# EAGLE design QuackDrive (EAGLE 9.2.2)

## Sheet 1 of 3
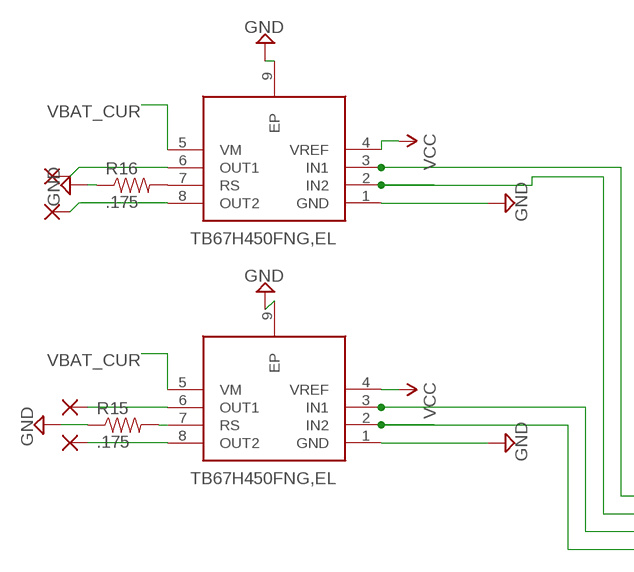
[diagram p0: schematic, sheet 1, part 1 of 2]
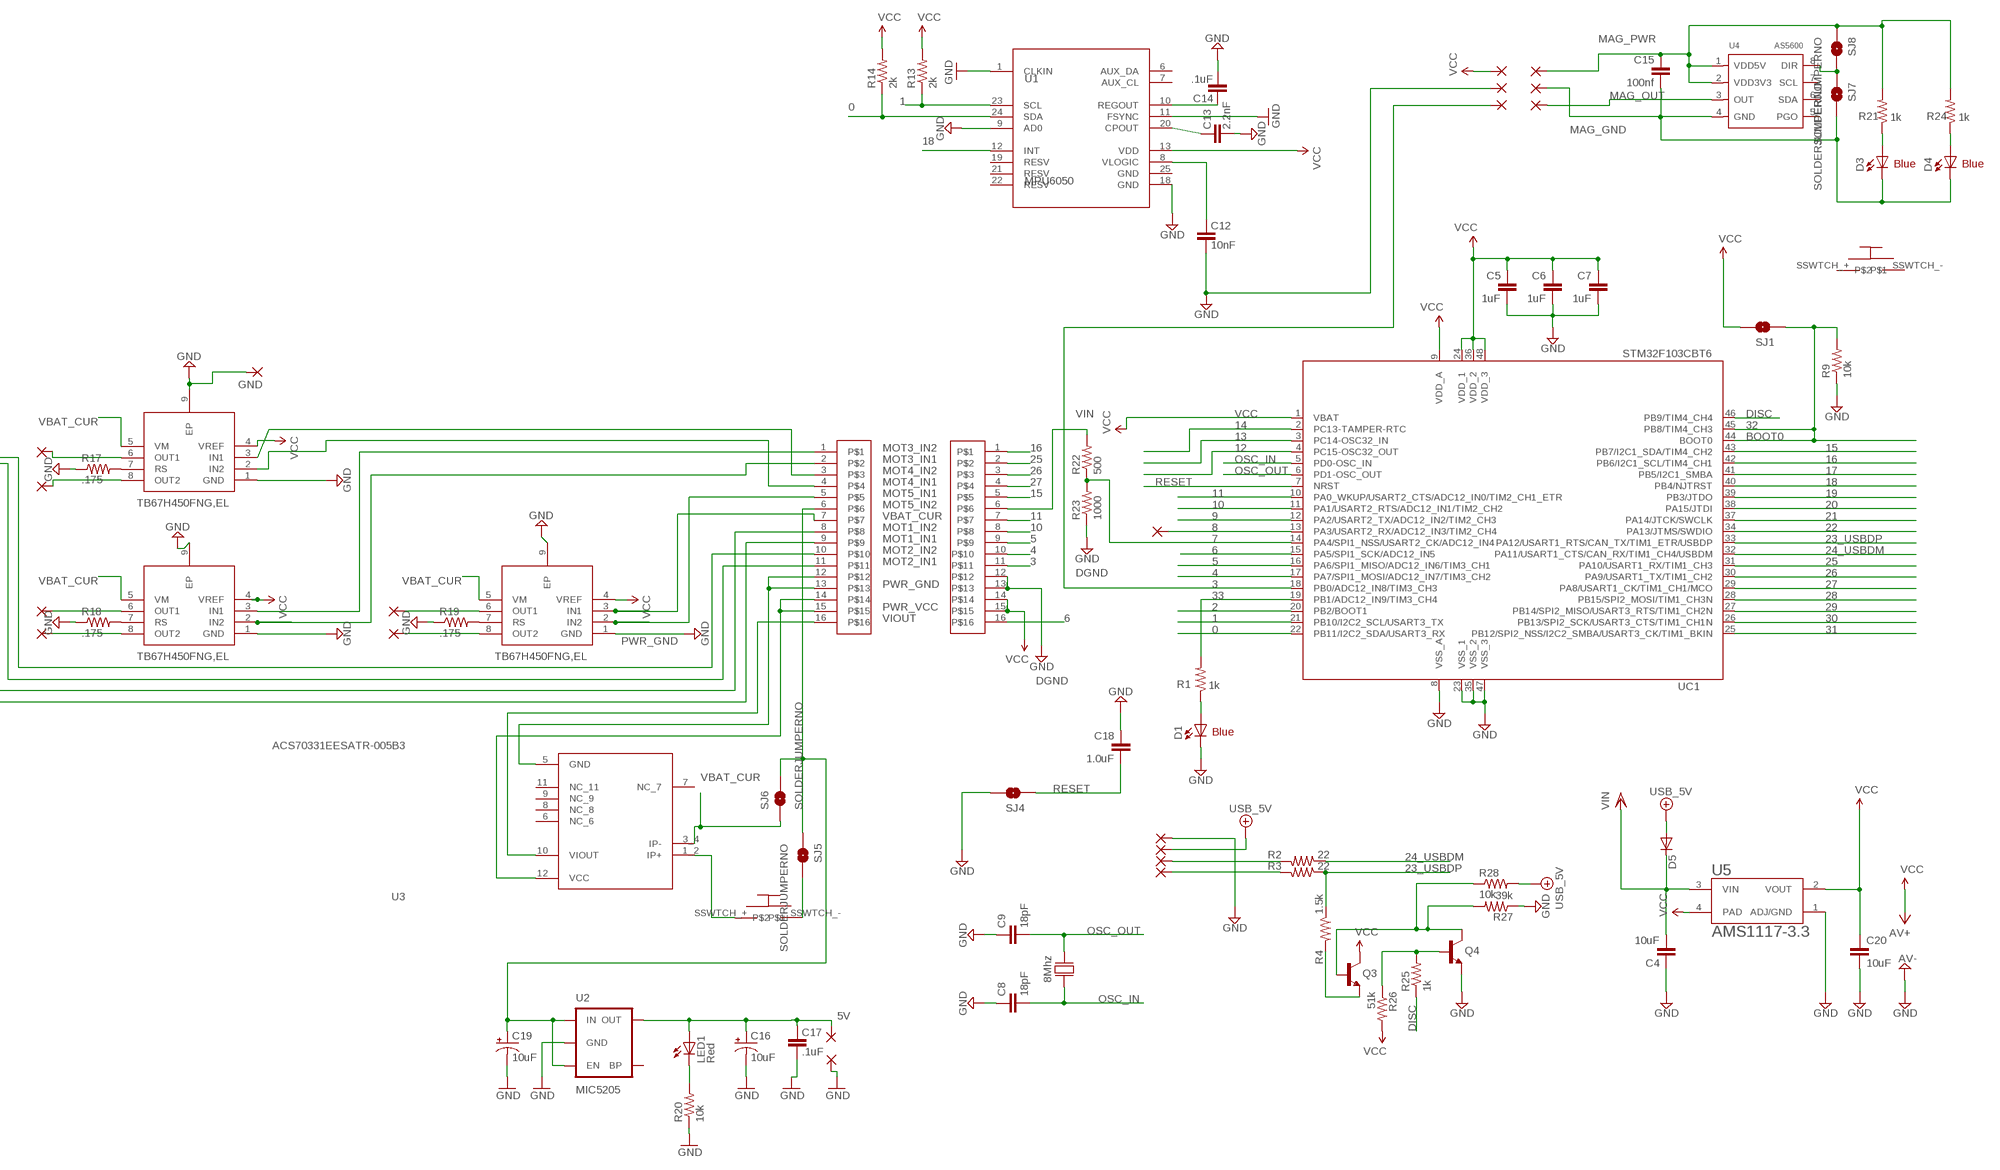
[diagram p1: schematic, sheet 1, part 2 of 2]

### Parts
C4  10uF  CAP0805  [0805]
C5  1uF  CAP0402  [C0402]
C6  1uF  CAP0402  [C0402]
C7  1uF  CAP0402  [C0402]
C8  18pF  18PF-0603-50V-5%  [0603]
C9  18pF  18PF-0603-50V-5%  [0603]
C12  10nF  CAP0402  [C0402]
C13  2.2nF  CAP0402  [C0402]
C14  .1uF  CAP0402  [C0402]
C15  100nf  CAP0402  [C0402]
C16  10uF  CAP_POL1206  [EIA3216]
C17  .1uF  CAP0402  [C0402]
C18  1.0uF  1.0UF-0603-16V-10%  [0603]
C19  10uF  CAP_POL1206  [EIA3216]
C20  10uF  CAP0805  [0805]
D1  Blue  LED1206  [LED-1206]
D3  Blue  LED1206  [LED-1206]
D4  Blue  LED1206  [LED-1206]
D5  DIODESOD  [SOD-323]
GND  SMD5  [SMD2,54-5,08]
IC4  TB67H450FNG,EL  [SOIC127P600X175-9N]
IC6  TB67H450FNG,EL  [SOIC127P600X175-9N]
IC8  TB67H450FNG,EL  [SOIC127P600X175-9N]
IC10  TB67H450FNG,EL  [SOIC127P600X175-9N]
IC12  TB67H450FNG,EL  [SOIC127P600X175-9N]
LED1  Red  LED  [0603-LED-ALT1]
PAD1  WIREPADSMD1,27-254  [SMD1,27-2,54]
PAD2  WIREPADSMD1,27-254  [SMD1,27-2,54]
PAD3  WIREPADSMD1,27-254  [SMD1,27-2,54]
PAD4  SMD2  [SMD1,27-2,54]
PAD5  WIREPADSMD1,27-254  [SMD1,27-2,54]
PAD6  WIREPADSMD1,27-254  [SMD1,27-2,54]
PAD7  SMD2  [SMD1,27-2,54]
PAD8  WIREPADSMD1,27-254  [SMD1,27-2,54]
PAD9  WIREPADSMD1,27-254  [SMD1,27-2,54]
PAD10  WIREPADSMD1,27-254  [SMD1,27-2,54]
PAD11  WIREPADSMD1,27-254  [SMD1,27-2,54]
PAD12  WIREPADSMD1,27-254  [SMD1,27-2,54]
PAD13  SMD2  [SMD1,27-2,54]
PAD14  SMD2  [SMD1,27-2,54]
PAD15  SMD2  [SMD1,27-2,54]
PAD16  SMD2  [SMD1,27-2,54]
PAD21  SMD2  [SMD1,27-2,54]
PAD22  SMD2  [SMD1,27-2,54]
PAD23  SMD2  [SMD1,27-2,54]
PAD24  SMD2  [SMD1,27-2,54]
PAD25  SMD2  [SMD1,27-2,54]
PAD26  SMD2  [SMD1,27-2,54]
PAD27  SMD2  [SMD1,27-2,54]
Q3  NPN-BJT  TRANSISTOR_NPNSOT23  [SOT23]
Q4  NPN-BJT  TRANSISTOR_NPNSOT23  [SOT23]
R1  1k  RESISTOR0402  [C0402]
R2  22  22OHM-0603-1/10W-1%  [0603]
R3  22  22OHM-0603-1/10W-1%  [0603]
R4  1.5k  22OHM-0603-1/10W-1%  [0603]
R9  10k  RESISTOR0402  [C0402]
R13  2k  RESISTOR0402  [C0402]
R14  2k  RESISTOR0402  [C0402]
R15  .175  RESISTOR0402  [C0402]
R16  .175  RESISTOR0402  [C0402]
R17  .175  RESISTOR0402  [C0402]
R18  .175  RESISTOR0402  [C0402]
R19  .175  RESISTOR0402  [C0402]
R20  10k  RESISTOR0402  [C0402]
R21  1k  RESISTOR0402  [C0402]
R22  500  RESISTOR0402  [C0402]
R23  1000  RESISTOR0402  [C0402]
R24  1k  RESISTOR0402  [C0402]
R25  1k  1KOHM-0603-1/10W-1%  [0603]
R26  51k  47KOHM-0603-1/10W-1%  [0603]
R27  39k  39KOHM-0603-1/10W-1%  [0603]
R28  10k  10KOHM-0603-1/10W-1%  [0603]
SJ1  SOLDERJUMPERNO  [SJ_2S-NO]
SJ4  SOLDERJUMPERNO  [SJ_2S-NO]
SJ5  SOLDERJUMPERNO  [SJ_2S-NO]
SJ6  SOLDERJUMPERNO  [SJ_2S-NO]
SJ7  SOLDERJUMPERNO  [SJ_2S-NO]
SJ8  SOLDERJUMPERNO  [SJ_2S-NO]
U1  MPU6050  [QFN50P400X400X95-25T265X275N]
U2  MIC5205  V_REG_LDOSMD  [SOT23-5]
U3  ACS70331EESATR-005B3  [XDCR_ACS70331EESATR-005B3]
U4  AS5600  SENSOR-AS5600  [SOIC8-1.27-5X4MM]
U5  AMS1117-3.3  [SOT229P700X180-4N]
U$1  WM8952DKR  [SOP80P420X355-16N]
U$2  SSWTCH  [SSWITCH]
U$3  WM8952DKR  [SOP80P420X355-16N]
U$4  SSWTCH  [SSWITCH]
U$9  8MHZCRYSTAL  [8MHZCRYSTAL]
UC1  STM32F103CBT6  STM32F103CB  [LQFP48]

### Nets
0: R14.1 U1.24(SDA) UC1.22(PB11/I2C2_SDA/USART3_RX)
1: R13.1 U1.23(SCL) UC1.21(PB10/I2C2_SCL/USART3_TX)
2: UC1.20(PB2/BOOT1)
3: PAD14.1(P) U$3.11 UC1.18(PB0/ADC12_IN8/TIM3_CH3)
4: U$3.10 UC1.17(PA7/SPI1_MOSI/ADC12_IN7/TIM3_CH2)
5: U$3.9 UC1.16(PA6/SPI1_MISO/ADC12_IN6/TIM3_CH1)
5V [vcc]: C16.A(+) C17.2 LED1.A PAD21.1(P) U2.5(OUT)
6: U$3.16 UC1.15(PA5/SPI1_SCK/ADC12_IN5)
7: R22.1 R23.2 UC1.14(PA4/SPI1_NSS/USART2_CK/ADC12_IN4)
8: PAD23.1(P) UC1.13(PA3/USART2_RX/ADC12_IN3/TIM2_CH4)
9: UC1.12(PA2/USART2_TX/ADC12_IN2/TIM2_CH3)
10: U$3.8 UC1.11(PA1/USART2_RTS/ADC12_IN1/TIM2_CH2)
11: U$3.7 UC1.10(PA0_WKUP/USART2_CTS/ADC12_IN0/TIM2_CH1_ETR)
12: UC1.4(PC15-OSC32_OUT)
13: UC1.3(PC14-OSC32_IN)
14: UC1.2(PC13-TAMPER-RTC)
15: U$3.5 UC1.43(PB7/I2C1_SDA/TIM4_CH2)
16: U$3.1 UC1.42(PB6/I2C1_SCL/TIM4_CH1)
17: UC1.41(PB5/I2C1_SMBA)
18: U1.12(INT) UC1.40(PB4/NJTRST)
19: UC1.39(PB3/JTDO)
20: UC1.38(PA15/JTDI)
21: UC1.37(PA14/JTCK/SWCLK)
22: UC1.34(PA13/JTMS/SWDIO)
23_USBDP: R3.1 R4.1 UC1.33(PA12/USART1_RTS/CAN_TX/TIM1_ETR/USBDP)
24_USBDM: R2.1 UC1.32(PA11/USART1_CTS/CAN_RX/TIM1_CH4/USBDM)
25: U$3.2 UC1.31(PA10/USART1_RX/TIM1_CH3)
26: U$3.3 UC1.30(PA9/USART1_TX/TIM1_CH2)
27: U$3.4 UC1.29(PA8/USART1_CK/TIM1_CH1/MCO)
28: UC1.28(PB15/SPI2_MOSI/TIM1_CH3N)
29: UC1.27(PB14/SPI2_MISO/USART3_RTS/TIM1_CH2N)
30: UC1.26(PB13/SPI2_SCK/USART3_CTS/TIM1_CH1N)
31: UC1.25(PB12/SPI2_NSS/I2C2_SMBA/USART3_CK/TIM1_BKIN)
32: R9.2 SJ1.1 UC1.44(BOOT0) UC1.45(PB8/TIM4_CH3)
33: R1.2 UC1.19(PB1/ADC12_IN9/TIM3_CH4)
+5V/2: D5.2(A) PAD25.1(P) R28.2 ; supply symbol labelled USB_5V
DGND: C4.1 C5.2 C6.2 C7.2 C8.1 C9.1 C12.1 C13.1 C14.1 C18.1 C20.2 D1.C PAD15.1(P) PAD24.1(P) Q4.2(E) R9.1 R23.1 R27.1 SJ4.2 U1.1(CLKIN) U1.9(AD0) U1.11(FSYNC) U1.18(GND) U5.1(ADJ/GND) U$3.12 U$3.13 UC1.8(VSS_A) UC1.23(VSS_1) UC1.35(VSS_2) UC1.47(VSS_3) ; supply symbol labelled GND, AV-
DISC: R25.1 UC1.46(PB9/TIM4_CH4)
MAG_GND: C15.2 D3.C D4.C PAD4.1(P) SJ7.2 U4.4(GND)
MAG_OUT: PAD13.1(P) U4.3(OUT)
MAG_PWR: C15.1 PAD7.1(P) R21.2 R24.2 SJ8.1 U4.1(VDD5V) U4.2(VDD3V3)
MOT1_IN1: IC4.2(IN2) U$1.9
MOT1_IN2: IC4.3(IN1) U$1.8
MOT2_IN1: IC6.2(IN2) U$1.11
MOT2_IN2: IC6.3(IN1) U$1.10
MOT3_IN1: IC8.2(IN2) U$1.2
MOT3_IN2: IC8.3(IN1) U$1.1
MOT4_IN1: IC10.2(IN2) U$1.4
MOT4_IN2: IC10.3(IN1) U$1.3
MOT5_IN1: IC12.2(IN2) U$1.5
MOT5_IN2: IC12.3(IN1) U$1.7
N$1: PAD27.1(P) R3.2
N$2: D1.A R1.1
N$3: PAD26.1(P) R2.2
N$4: Q3.2(E) R4.2
N$5: Q4.1(B) R25.2 R26.1
N$6: SJ5.2 U$2.SSWTCH_-
N$7: C12.2 U1.8(VLOGIC)
N$8: C13.2 U1.20(CPOUT)
N$9: C14.2 U1.10(REGOUT)
N$10: Q3.1(B) Q4.3(C) R27.2 R28.1
N$11: IC12.8(OUT2) PAD5.1(P)
N$12: IC6.7(RS) R16.2
N$13: IC12.6(OUT1) PAD6.1(P)
N$14: IC8.6(OUT1) PAD2.1(P)
N$15: IC8.8(OUT2) PAD1.1(P)
N$17: IC10.6(OUT1) PAD8.1(P)
N$18: IC10.8(OUT2) PAD3.1(P)
N$19: IC6.6(OUT1) PAD12.1(P)
N$20: IC6.8(OUT2) PAD11.1(P)
N$21: IC4.6(OUT1) PAD10.1(P)
N$22: IC4.8(OUT2) PAD9.1(P)
N$23: IC10.7(RS) R17.2
N$24: IC8.7(RS) R18.2
N$25: IC12.7(RS) R19.2
N$26: IC4.7(RS) R15.2
N$28: D3.A R21.1
N$29: SJ7.1 SJ8.2 U4.8(DIR)
N$30: LED1.C R20.2
N$32: D4.A R24.1
OSC_IN: C8.2 U$9.P$1 UC1.5(PD0-OSC_IN)
OSC_OUT: C9.2 U$9.P$2 UC1.6(PD1-OSC_OUT)
PWR_GND: C16.C(-) C17.1 C19.C(-) GND.1(P) IC4.1(GND) IC4.9(EP) IC6.1(GND) IC6.9(EP) IC8.1(GND) IC8.9(EP) IC10.1(GND) IC10.9(EP) IC12.1(GND) IC12.9(EP) PAD22.1(P) R15.1 R16.1 R17.1 R18.1 R19.1 R20.1 U2.2(GND) U3.5(GND) U$1.12 U$1.13 ; supply symbol labelled GND
PWR_VCC: IC4.4(VREF) IC6.4(VREF) IC8.4(VREF) IC10.4(VREF) IC12.4(VREF) U3.12(VCC) U$1.14 U$1.15 ; supply symbol labelled VCC
RESET: C18.2 SJ4.1 UC1.7(NRST)
VBAT_CUR: C19.A(+) IC4.5(VM) IC6.5(VM) IC8.5(VM) IC10.5(VM) IC12.5(VM) SJ5.1 SJ6.1 SJ6.2 U2.1(IN) U2.3(EN) U3.3_4(IP-) U$1.6
VBAT_IN: U3.1_2(IP+) U$2.SSWTCH_+
VCC: C5.1 C6.1 C7.1 C20.1 PAD16.1(P) Q3.3(C) R13.2 R14.2 R26.2 SJ1.2 U1.13(VDD) U5.2(VOUT) U5.4(PAD) U$3.14 U$3.15 UC1.1(VBAT) UC1.9(VDD_A) UC1.24(VDD_1) UC1.36(VDD_2) UC1.48(VDD_3) ; supply symbol labelled AV+
VIN: C4.2 D5.1(C) R22.2 U5.3(VIN) U$3.6
VIOUT: U3.10(VIOUT) U$1.16
Unconnected: U1.2(NC) U1.3(NC) U1.4(NC) U1.5(NC) U1.6(AUX_DA) U1.7(AUX_CL) U1.14(NC) U1.15(NC) U1.16(NC) U1.17(NC) U1.19(RESV) U1.21(RESV) U1.22(RESV) U2.4(BP) U3.6(NC_6) U3.7(NC_7) U3.8(NC_8) U3.9(NC_9) U3.11(NC_11) U4.5(PGO) U4.6(SDA) U4.7(SCL) U$4.SSWTCH_+ U$4.SSWTCH_-

### Notes on the sheet
- Blue | Blue
- BOOT0
- Blue

## Sheet 2 of 3
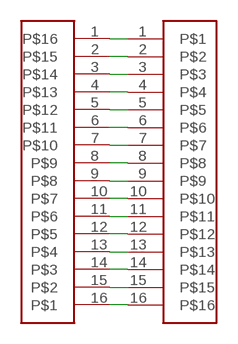
[diagram p2: schematic, sheet 2]

### Parts
U$5  WM8952DKR  [SOP80P420X355-16N]
U$6  WM8952DKR  [SOP80P420X355-16N]

### Nets
N$16: U$5.1 U$6.1
N$34: U$5.2 U$6.2
N$35: U$5.3 U$6.3
N$36: U$5.4 U$6.4
N$37: U$5.5 U$6.5
N$38: U$5.6 U$6.6
N$39: U$5.7 U$6.7
N$40: U$5.8 U$6.8
N$41: U$5.9 U$6.9
N$42: U$5.10 U$6.10
N$43: U$5.11 U$6.11
N$44: U$5.12 U$6.12
N$45: U$5.13 U$6.13
N$46: U$5.14 U$6.14
N$47: U$5.15 U$6.15
N$48: U$5.16 U$6.16

## Sheet 3 of 3
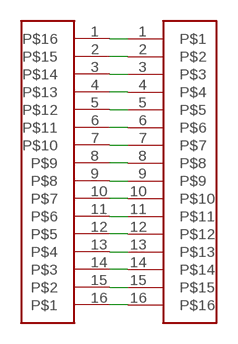
[diagram p3: schematic, sheet 3]

### Parts
U$7  WM8952DKR  [SOP80P420X355-16N]
U$8  WM8952DKR  [SOP80P420X355-16N]

### Nets
N$33: U$7.1 U$8.1
N$49: U$7.2 U$8.2
N$50: U$7.3 U$8.3
N$52: U$7.4 U$8.4
N$53: U$7.5 U$8.5
N$54: U$7.6 U$8.6
N$55: U$7.7 U$8.7
N$56: U$7.8 U$8.8
N$57: U$7.9 U$8.9
N$58: U$7.10 U$8.10
N$61: U$7.11 U$8.11
N$62: U$7.12 U$8.12
N$63: U$7.13 U$8.13
N$64: U$7.14 U$8.14
N$65: U$7.15 U$8.15
N$66: U$7.16 U$8.16

## Power pins joined to a net without a drawn wire
DGND: U1.25(GND)

## Library data of the parts
C4 C20 = SparkFun2:CAP: Capacitor Standard 0603 ceramic capacitor, and 0.1" leaded capacitor.
C5-C7 C12-C15 C17 = SparkFun:CAP: Capacitor Standard 0603 ceramic capacitor, and 0.1" leaded capacitor.
C8 C9 = SparkFun-Capacitors:18PF: 18pF ceramic capacitors A capacitor is a passive two-terminal electrical component used to store electrical energy temporarily in an electric field.; PROD_ID: CAP-08267
C16 C19 = SparkFun:CAP_POL: Capacitor Polarized These are standard SMD and PTH capacitors. Normally 10uF, 47uF, and 100uF in electrolytic and tantalum varieties. Always verify the external diameter of the through hole cap, it varies with capacity, voltage, and manufacturer. The EIA devices should be standard.
C18 = SparkFun-Capacitors:1.0UF: 1µF ceramic capacitors A capacitor is a passive two-terminal electrical component used to store electrical energy temporarily in an electric field.; PROD_ID: CAP-00868
D1 D3 D4 = SparkFun:LED: LEDs Standard schematic elements and footprints for 5mm, 3mm, 1206, and 0603 sized LEDs. 5mm - Spark Fun Electronics SKU : COM-00529 (and others)
D5 = SparkFun3:DIODE: Diode These are standard reverse protection diodes and small signal diodes. SMA package can handle up to about 1A. SOD-323 can handle about 200mA. What the SOD-323 package when ordering, there are some mfgs out there that are 5-pin packages.
GND = wirepad:SMD5: SMD PAD
IC4 IC6 IC8 IC10 IC12 = TB67H450FNG_EL:TB67H450FNG,EL: Motor / Motion / Ignition Controllers & Drivers Brushed Motor Driver IC, 50V, 3.5A, TSSOP8 Package, PB-FREE Source: Datasheet <http://toshiba.semicon-storage.com/info/docget.jsp?did=65346&prodName=TB67H450FNG>; DESCRIPTION: Motor / Motion / Ignition Controllers & Drivers Brushed Motor Driver IC, 50V, 3.5A, TSSOP8 Package, PB-FREE; HEIGHT: 1.75mm; MANUFACTURER_NAME: Toshiba; MANUFACTURER_PART_NUMBER: TB67H450FNG,EL; MOUSER_PART_NUMBER: 757-TB67H450FNGEL; MOUSER_PRICE-STOCK: https://www.mouser.com/Search/Refine.aspx?Keyword=757-TB67H450FNGEL
LED1 = Testing:LED: LEDs Standard schematic elements and footprints for 5mm, 3mm, 1206, and 0603 sized LEDs. 5mm - Spark Fun Electronics SKU : COM-00529 (and others)
PAD1-PAD3 PAD5 PAD6 PAD8-PAD12 = wirepad:WIREPAD: Wire PAD connect wire on PCB
PAD4 PAD7 PAD13-PAD16 PAD21-PAD27 = wirepad:SMD2: SMD PAD
Q3 Q4 = SparkFun2:TRANSISTOR_NPN: Transistor NPN BJT configuration in SOT23 package. MMBT2222 is the common NPN we use. Double check BCE configuration again layout.
R1 R9 R13-R24 = SparkFun:RESISTOR: Resistor Basic schematic elements and footprints for 0603, 1206, and PTH 1/10th watt (small) resistors.
R2 R3 = SparkFun-Resistors:22OHM: 22Ω resistor A resistor is a passive two-terminal electrical component that implements electrical resistance as a circuit element. Resistors act to reduce current flow, and, at the same time, act to lower voltage levels within circuits. - Wikipedia; PROD_ID: RES-08698
R4 = SparkFun-Resistors:22OHM: 22Ω resistor A resistor is a passive two-terminal electrical component that implements electrical resistance as a circuit element. Resistors act to reduce current flow, and, at the same time, act to lower voltage levels within circuits. - Wikipedia; PROD_ID: RES-08698; VALUE: 22
R25 = SparkFun-Resistors:1KOHM: 1kΩ resistor A resistor is a passive two-terminal electrical component that implements electrical resistance as a circuit element. Resistors act to reduce current flow, and, at the same time, act to lower voltage levels within circuits. - Wikipedia; PROD_ID: RES-07856
R26 = SparkFun-Resistors:47KOHM: 47kΩ resistor A resistor is a passive two-terminal electrical component that implements electrical resistance as a circuit element. Resistors act to reduce current flow, and, at the same time, act to lower voltage levels within circuits. - Wikipedia; PROD_ID: RES-07871; VALUE: 47k
R27 = SparkFun-Resistors:39KOHM: 39kΩ resistor A resistor is a passive two-terminal electrical component that implements electrical resistance as a circuit element. Resistors act to reduce current flow, and, at the same time, act to lower voltage levels within circuits. - Wikipedia; PROD_ID: RES-12377
R28 = SparkFun-Resistors:10KOHM: 10kΩ resistor A resistor is a passive two-terminal electrical component that implements electrical resistance as a circuit element. Resistors act to reduce current flow, and, at the same time, act to lower voltage levels within circuits. - Wikipedia; PROD_ID: RES-00824
SJ1 SJ4-SJ8 = SparkFun:SOLDERJUMPER: Solder Jumper Standard SMD solder jumper. Used to automate production. Two varients : Normally Open and Normally Closed are the same, but have different paste layers. NC will have a large amount of paste and should jumper during reflow.
U1 = invensense:MPU6050: The triple-axis MEMS gyroscope
U2 = SparkFun:V_REG_LDO: Voltage Regulator LDO Standard 150mA LDO voltage regulator in SOT-23 layout. Micrel part MIC5205. BP (by-pass) pin is used to lower output noise with 470pF cap.
U3 = ACS70331EESATR-005B3:ACS70331EESATR-005B3: Current Sensor Current Sensor AC/DC Current 12-Pin QFN EP T/R; DESCRIPTION: Current Sensor Current Sensor AC/DC Current 12-Pin QFN EP T/R; DIGI-KEY_PART_NUMBER: 620-1887-1-ND; DIGI-KEY_PURCHASE_URL: https://www.digikey.com/product-detail/en/allegro-microsystems/ACS70331EESATR-005B3/620-1887-1-ND/8120687?utm_source=snapeda&utm_medium=aggregator&utm_campaign=symbol; MF: Allegro MicroSystems LLC; MP: ACS70331EESATR-005B3; PACKAGE: WFQFN-12 Allegro MicroSystems LLC
U4 = Sensor:SENSOR-AS5600
U5 = AMS1117-3.3:AMS1117-3.3: Sot223/Pkg 1-Amp 3.3-Volt Low Drop Out Voltage Regulatator; AVAILABILITY: Unavailable; DESCRIPTION: Sot223/Pkg 1-Amp 3.3-Volt Low Drop Out Voltage Regulatator; MF: Advanced Monolithic Systems; MP: AMS1117-3.3; PACKAGE: None; PRICE: None
U$1 U$5 = WM8952DKR:WM8952DKR
U$2 = Safet switch:SSWTCH
U$3 = WM8952DKR FW:WM8952DKR
U$4 = Safet switch other side:SSWTCH
U$6 = WM8952DKR other half:WM8952DKR
U$7 = WM8952DKR F:WM8952DKR
U$8 = WM8952DKR F other half:WM8952DKR
U$9 = Maple Mini Clone:8MHZCRYSTAL
UC1 = stm32:STM32F103CB

## Net classes
0 Default: width 0.203 mm
1 vcc: width 0.254 mm

## Board
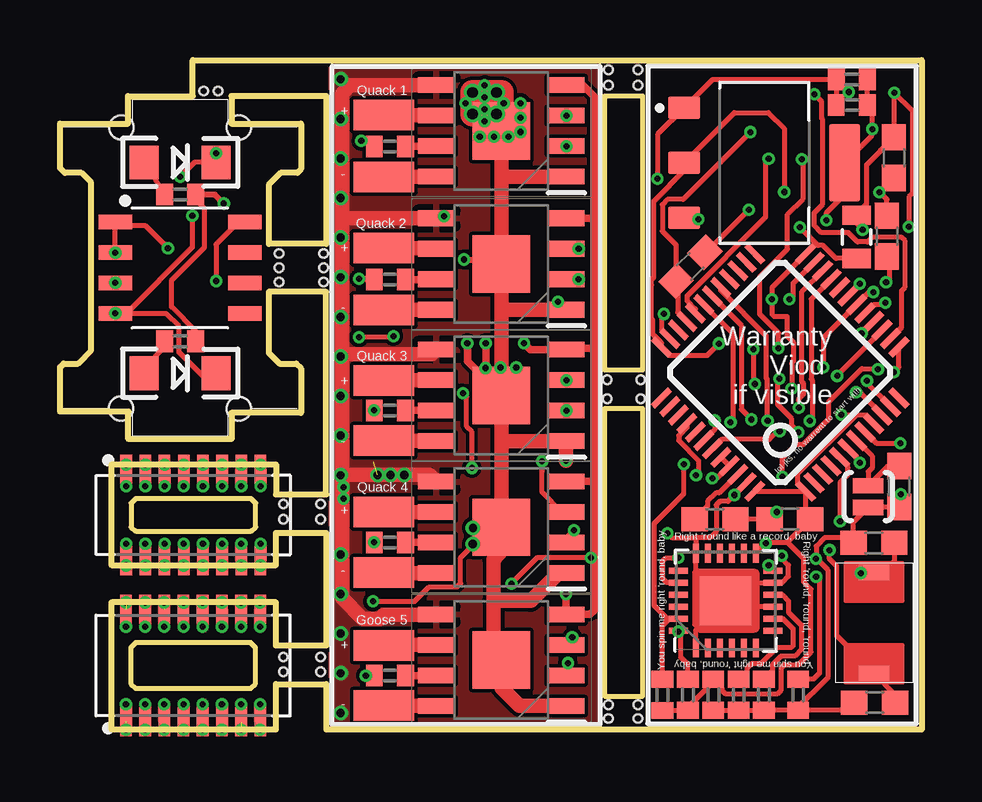
[diagram p4: board, top side]
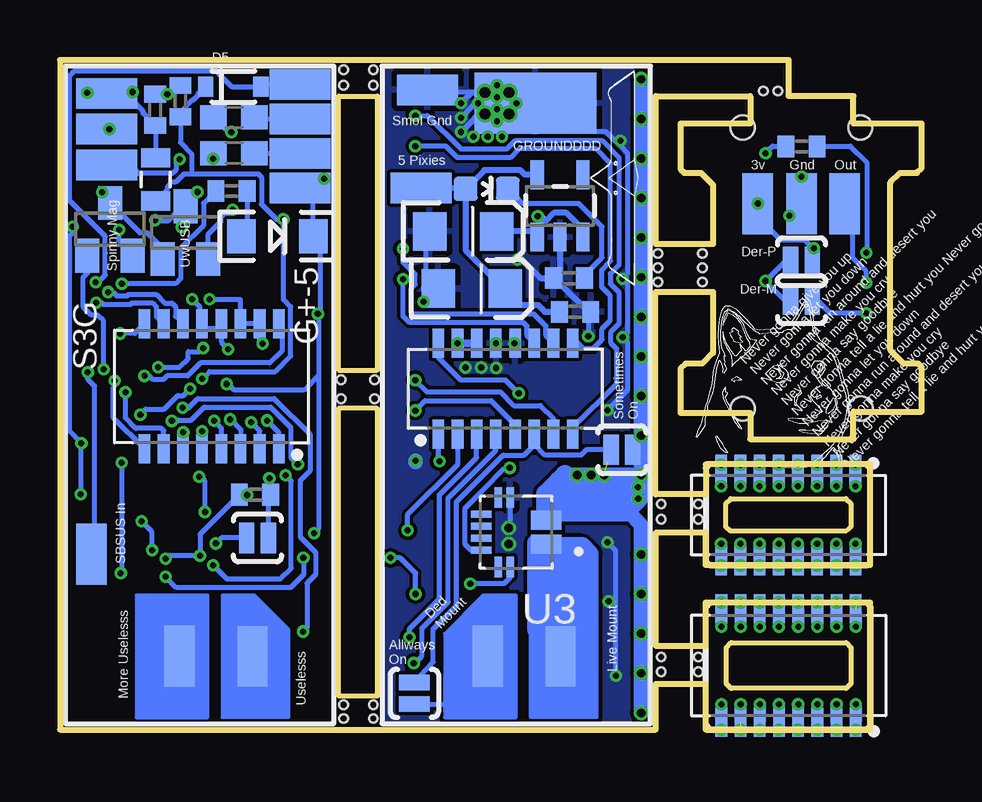
[diagram p5: board, bottom side, seen from below]

Size 35.92 x 27.9 mm. Coordinates in mm from the lower left corner, seen from the top.
Outline: 2.84,25.25 2.84,26.4 5.54,26.4 5.54,27.9 35.92,27.9 35.92,0 11.1,0 11.1,1.9 9,1.9 9,0 2.15,0 2.15,5.3 9,5.3 9,3.5 11.1,3.5 11.1,8.2 9,8.2 9,6.85 2.15,6.85 2.15,11.05 9,11.05 9,9.8 11.1,9.8 11.1,18.24 8.7,18.24 8.7,15.7 9.15,15.25 9.85,15.25 10.05,15.05 10.05,13.2 7.15,13.2 7.15,12.1 2.85,12.1 2.85,13.25 0,13.25 0,15.1 0.15,15.25 0.75,15.25 1.3,15.8 1.3,22.8 0.9,23.2 0.2,23.2 0,23.4 0,25.25 2.84,25.25
Outline: 24.3,26.4 22.7,26.4 22.7,14.98 24.3,14.98 24.3,26.4
Outline: 22.7,13.38 22.7,1.4 24.3,1.4 24.3,13.38 22.7,13.38
Outline: 11.1,26.4 11.1,20.24 8.7,20.24 8.7,22.7 9.2,23.2 9.9,23.2 10.05,23.35 10.05,25.25 7.15,25.25 7.15,26.4 11.1,26.4
Outline: 8.16,8.44 8.16,9.44 7.96,9.63 3.16,9.63 2.96,9.44 2.96,8.44 3.17,8.26 7.97,8.26 8.16,8.44
Outline: 8.15,1.92 8.15,3.42 7.95,3.62 3.15,3.62 2.95,3.42 2.95,1.92 3.15,1.72 7.95,1.72 8.15,1.92
Copper layers (1*16): Top 0.07mm / dielectric 0.8mm / Bottom 0.07mm
Design rules "default *": minimum track width 6mil, minimum drill 10mil, track to track 6mil, track to pad 6mil, pad to pad 6mil, via to via 6mil, smd to smd 0mil, copper to edge 6mil, drill to drill 6mil, minimum pad ring 5mil, minimum via ring 5mil, stop-mask expansion 4mil, vias tented up to drill 50mil, thermal gap 10mil
Holes 1 mm at 2.56,25.09 7.46,25.08 7.46,13.37 2.55,13.38
Holes 0.35 mm at 5.99,26.61 6.6,26.61 9.14,18.65 9.14,19.25 9.14,19.84 10.99,18.65 10.99,19.25 10.99,19.84 9.31,9.4 9.31,8.76 10.86,9.4 10.86,8.76 9.31,3.03 9.31,2.41 10.86,2.41 10.86,3.03 22.86,1.04 22.86,0.46 24.09,1.04 24.09,0.46 22.86,27.5 22.86,26.85 24.09,27.5 24.09,26.85 22.81,13.78 22.81,14.58 24.21,14.58 24.21,13.78

### Footprints (pad centres in the part's own frame; a part is rotated, then mirrored left to right if it is on the bottom)
0805 = smd 0.8 x 1.2: 1 -0.9,0; 2 0.9,0
C0402 = smd 0.7 x 0.9: 1 -0.65,0; 2 0.65,0
0603 = smd 1.1 x 1: 1 -0.85,0; 2 0.85,0
EIA3216 = smd 1.4 x 1.6: A 1.4,0; C -1.4,0
LED-1206 = smd 1.2 x 1.4: A -1.5,0; C 1.5,0
SOD-323 = smd 0.63 x 0.83: 1 -1.15,0; 2 1.15,0
SMD2,54-5,08 = smd 2.54 x 5.08: 1 0,0
SOIC127P600X175-9N = smd 1.525 x 0.65: 1 -2.712,1.905; 2 -2.712,0.635; 3 -2.712,-0.635; 4 -2.712,-1.905; 5 2.712,-1.905; 6 2.712,-0.635; 7 2.712,0.635; 8 2.712,1.905 | smd 2.39 x 2.39: 9 0,0
0603-LED-ALT1 = smd 1 x 1: A 0,-0.877; C 0,0.877
SMD1,27-2,54 = smd 1.27 x 2.54: 1 0,0
SOT23 = smd 1 x 1.4: 1 -0.95,-1.1; 2 0.95,-1.1; 3 0,1.1
SJ_2S-NO = smd 0.635 x 1.27: 1 -0.45,0; 2 0.45,0
QFN50P400X400X95-25T265X275N = smd 0.26 x 0.79: 1 -1.25,-1.97; 2 -0.75,-1.97; 3 -0.25,-1.97; 4 0.25,-1.97; 5 0.75,-1.97; 6 1.25,-1.97; 13 1.25,1.97; 14 0.75,1.97; 15 0.25,1.97; 16 -0.25,1.97; 17 -0.75,1.97; 18 -1.25,1.97 | smd 0.79 x 0.26: 7 1.97,-1.25; 8 1.97,-0.75; 9 1.97,-0.25; 10 1.97,0.25; 11 1.97,0.75; 12 1.97,1.25; 19 -1.97,1.25; 20 -1.97,0.75; 21 -1.97,0.25; 22 -1.97,-0.25; 23 -1.97,-0.75; 24 -1.97,-1.25 | smd 2.15 x 2.05: 25 0,0
SOT23-5 = smd 0.55 x 1.2: 1 -0.95,-1.3; 2 0,-1.3; 3 0.95,-1.3; 4 0.95,1.3; 5 -0.95,1.3
XDCR_ACS70331EESATR-005B3 = smd 1.27 x 0.8: 1_2 -1.25,0.5; 3_4 -1.25,-0.5 | smd 0.3 x 0.85: 5 0.25,-1.45; 6 0.75,-1.45; 11 0.75,1.45; 12 0.25,1.45 | smd 0.85 x 0.3: 7 1.45,-0.75; 8 1.45,-0.25; 9 1.45,0.25; 10 1.45,0.75
SOIC8-1.27-5X4MM = smd 0.6 x 1.4: 1 -1.905,-2.7; 2 -0.635,-2.7; 3 0.635,-2.7; 4 1.905,-2.7; 5 1.905,2.7; 6 0.635,2.7; 7 -0.635,2.7; 8 -1.905,2.7
SOT229P700X180-4N = smd 0.93 x 1.31: 1 -2.29,-3.345; 2 0,-3.345; 3 2.29,-3.345 | smd 3.24 x 1.31: 4 0,3.345
SOP80P420X355-16N = smd 1.212 x 0.484: 1 -1.9,2.8; 2 -1.9,2; 3 -1.9,1.2; 4 -1.9,0.4; 5 -1.9,-0.4; 6 -1.9,-1.2; 7 -1.9,-2; 8 -1.9,-2.8; 9 1.9,-2.8; 10 1.9,-2; 11 1.9,-1.2; 12 1.9,-0.4; 13 1.9,0.4; 14 1.9,1.2; 15 1.9,2; 16 1.9,2.8
SSWITCH = smd 1.25 x 2.5: SSWTCH_+ 0,0 | smd 1.27 x 2.54: SSWTCH_- 3.048,0
SOP80P420X355-16N' = smd 1.212 x 0.484: 1 -3.304,-2.8; 2 -3.304,-2; 3 -3.304,-1.2; 4 -3.304,-0.4; 5 -3.304,0.4; 6 -3.304,1.2; 7 -3.304,2; 8 -3.304,2.8; 9 1.91,2.8; 10 1.91,2; 11 1.91,1.2; 12 1.91,0.4; 13 1.91,-0.4; 14 1.91,-1.2; 15 1.91,-2; 16 1.91,-2.8
SOP80P420X355-16N'' = smd 1.212 x 0.484: 1 1.91,2.8; 2 1.91,2; 3 1.91,1.2; 4 1.91,0.4; 5 1.91,-0.4; 6 1.91,-1.2; 7 1.91,-2; 8 1.91,-2.8; 9 -1.91,-2.8; 10 -1.91,-2; 11 -1.91,-1.2; 12 -1.91,-0.4; 13 -1.91,0.4; 14 -1.91,1.2; 15 -1.91,2; 16 -1.91,2.8
SOP80P420X355-16N''' = smd 1.212 x 0.484: 1 -2.8,2.8; 2 -2.8,2; 3 -2.8,1.2; 4 -2.8,0.4; 5 -2.8,-0.4; 6 -2.8,-1.2; 7 -2.8,-2; 8 -2.8,-2.8; 9 1.9,-2.8; 10 1.9,-2; 11 1.9,-1.2; 12 1.9,-0.4; 13 1.9,0.4; 14 1.9,1.2; 15 1.9,2; 16 1.9,2.8
SOP80P420X355-16N'''' = smd 1.212 x 0.484: 1 1.91,2.8; 2 1.91,2; 3 1.91,1.2; 4 1.91,0.4; 5 1.91,-0.4; 6 1.91,-1.2; 7 1.91,-2; 8 1.91,-2.8; 9 -2.81,-2.8; 10 -2.81,-2; 11 -2.81,-1.2; 12 -2.81,-0.4; 13 -2.81,0.4; 14 -2.81,1.2; 15 -2.81,2; 16 -2.81,2.8
8MHZCRYSTAL = smd 0.635 x 1.27: P$1 -2.1,0; P$2 2.1,0
LQFP48 = smd 0.254 x 1: 1 -2.75,-4.25; 2 -2.25,-4.25; 3 -1.75,-4.25; 4 -1.25,-4.25; 5 -0.75,-4.25; 6 -0.25,-4.25; 7 0.25,-4.25; 8 0.75,-4.25; 9 1.25,-4.25; 10 1.75,-4.25; 11 2.25,-4.25; 12 2.75,-4.25; 25 2.75,4.25; 26 2.25,4.25; 27 1.75,4.25; 28 1.25,4.25; 29 0.75,4.25; 30 0.25,4.25; 31 -0.25,4.25; 32 -0.75,4.25; 33 -1.25,4.25; 34 -1.75,4.25; 35 -2.25,4.25; 36 -2.75,4.25 | smd 1 x 0.254: 13 4.25,-2.75; 14 4.25,-2.25; 15 4.25,-1.75; 16 4.25,-1.25; 17 4.25,-0.75; 18 4.25,-0.25; 19 4.25,0.25; 20 4.25,0.75; 21 4.25,1.25; 22 4.25,1.75; 23 4.25,2.25; 24 4.25,2.75; 37 -4.25,2.75; 38 -4.25,2.25; 39 -4.25,1.75; 40 -4.25,1.25; 41 -4.25,0.75; 42 -4.25,0.25; 43 -4.25,-0.25; 44 -4.25,-0.75; 45 -4.25,-1.25; 46 -4.25,-1.75; 47 -4.25,-2.25; 48 -4.25,-2.75

### Placement (x,y rotation side)
C4  31.94,22.93 270 bottom
C5  33.01,27.09 180 top
C6  27.23,1.45 270 top
C7  33.01,26.03 180 top
C8  33.96,1.12 0 top
C9  33.93,7.78 0 top
C12  28.29,1.45 90 top
C13  30.77,1.45 90 top
C14  29.34,1.45 90 top
C15  5.01,24.3 180 bottom
C16  18.76,18.37 0 bottom
C17  14.44,17.41 180 bottom
C18  34.99,10.13 90 top
C19  19.11,20.76 0 bottom
C20  33.21,20.53 90 top
D1  26.86,20.56 0 bottom
D3  5.01,23.63 0 top
D4  5.01,14.85 0 top
D5  28.7,26.79 0 bottom
GND  16.1,26.1 90 bottom
IC4  18.4,24.95 180 top
IC6  18.4,19.4 180 top
IC8  18.4,8.43 180 top
IC10  18.4,2.9 180 top
IC12  18.4,13.93 180 top
LED1  18.13,22.53 270 bottom
PAD1  13.5,6.55 90 top
PAD2  13.5,9.07 270 top
PAD3  13.5,1 90 top
PAD4  5.01,21.92 0 bottom
PAD5  13.5,12.04 90 top
PAD6  13.5,14.54 90 top
PAD7  6.83,21.92 0 bottom
PAD8  13.5,3.5 90 top
PAD9  13.5,23.03 270 top
PAD10  13.5,25.6 270 top
PAD11  13.5,17.49 90 top
PAD12  13.5,20.06 270 top
PAD13  3.22,21.92 0 bottom
PAD14  33.98,23.53 270 bottom
PAD15  33.98,26.51 270 bottom
PAD16  33.98,25.02 270 bottom
PAD21  20.88,22.57 270 bottom
PAD22  20.6,26.65 270 bottom
PAD23  34.62,7.31 0 bottom
PAD24  25.92,22.57 270 bottom
PAD25  25.92,26.89 270 bottom
PAD26  25.92,24.01 90 bottom
PAD27  25.92,25.45 270 bottom
Q3  30.69,20.71 0 bottom
Q4  33.83,20.84 0 bottom
R1  28.77,22.44 180 bottom
R2  28.67,24.02 0 bottom
R3  28.67,25.51 0 bottom
R4  26.28,19.29 45 top
R9  27.79,9.79 0 bottom
R13  25.11,1.44 270 top
R14  26.18,1.45 270 top
R15  13.75,24.3 0 top
R16  13.75,18.75 0 top
R17  13.75,2.25 0 top
R18  13.75,7.8 0 top
R19  13.75,13.3 0 top
R20  14.71,18.81 0 bottom
R21  5.01,22.3 0 top
R22  30.9,26.19 270 bottom
R23  31.96,25.82 90 bottom
R24  5.01,16.18 0 top
R25  27.31,8.76 0 top
R26  30.43,8.77 0 top
R27  34.77,23.83 270 top
R28  34.48,20.56 270 top
SJ1  27.69,7.99 180 bottom
SJ4  33.7,9.71 270 top
SJ5  21.15,1.51 270 bottom
SJ6  12.5,11.66 180 bottom
SJ7  5.01,17.92 0 bottom
SJ8  5.01,19.49 180 bottom
U1  27.75,5.37 0 top
U2  15.07,21.82 0 bottom
U3  16.9,8.22 180 bottom
U4  5.01,19.24 270 top
U5  29.37,23.62 270 top
U$1  17.35,14.2 90 bottom
U$2  15.05,3.05 180 bottom
U$3  WM8952DKR  [SOP80P420X355-16N']  29.6,15 90 bottom
U$4  27.9,3.05 180 bottom
U$5  5.56,8.94 270 bottom
U$6  WM8952DKR  [SOP80P420X355-16N'']  5.56,8.94 90 top
U$7  WM8952DKR  [SOP80P420X355-16N''']  5.55,3.12 90 top
U$8  WM8952DKR  [SOP80P420X355-16N'''']  5.55,2.22 270 bottom
U$9  33.94,4.44 90 top
UC1  30.03,14.88 45 top

### Tracks (layer width: path | path; a pad name or v marks a point on that pad's centre or on a via)
0  (via drill 0.25)
  Top 0.203: R14.1 26.18,2.72 25.86,3.03 25.86,4 v25.79,4.08 U1.24 | v30.8,13.41 30.8,13.79 31.01,13.99 31.01,14.41 30.93,14.48 30.93,18.26 UC1.22
  Bottom 0.203: v25.79,4.08 25.62,4.25 25.62,6.09 25.27,6.45 25.27,7.4 25.9,8.04 25.9,10.38 25.5,10.78 25.5,12.3 26.99,13.79 30.18,13.79 30.56,13.41 v30.8,13.41
1  (via drill 0.25)
  Top 0.203: U1.23 25.4,4.62 25.37,4.58 | R13.1 25.11,4.33 25.37,4.58 | v26.01,11.05 26.01,9.82 24.78,8.59 24.78,5.17 25.37,4.58 | UC1.21 31.32,17.94 31.32,14.6 31.36,14.56 31.36,12.97 v31.26,12.86
  Bottom 0.203: v26.01,11.05 26.3,11.35 26.3,12.61 27.14,13.44 29.91,13.44 30.45,12.9 30.99,12.9 31.03,12.86 v31.26,12.86
3  (via drill 0.25)
  Top 0.203: v33.91,18.23 33.73,18.23 UC1.18 31.82,16.33 v31.82,15.1 | v29.95,15.9 29.95,16.54 29.18,17.31 29.18,18.86 30.33,20.02 30.33,21.47 30.98,22.12 30.98,23.72 v30.93,23.77
  Bottom 0.203: v31.82,15.1 30.95,15.1 30.58,15.46 30.58,15.75 30.09,15.75 v29.95,15.9 | v30.93,23.77 31.09,23.62 31.09,23.32 31.23,23.17 32.64,23.17 33.01,23.53 PAD14.1 | v33.91,18.23 33.71,18.23 33.55,18.07 33.13,18.07 33.06,18.14 31.92,18.14 31.55,17.77 31.25,17.77 31.1,17.62 31.1,17.21 U$3.11
4  (via drill 0.25)
  Top 0.203: UC1.17 33.91,17.7 34.3,17.7 34.39,17.78 v34.41,17.78
  Bottom 0.203: U$3.10 31.9,17.21 31.9,17.62 32.06,17.78 32.92,17.78 32.98,17.72 34.12,17.72 34.18,17.78 v34.41,17.78
5  (via drill 0.25)
  Top 0.203: v33.42,16.51 | v33.42,16.51 UC1.16
  Bottom 0.203: U$3.9 32.8,16.51 v33.42,16.51
5V
  Bottom 0.254: PAD21.1 19.05,22.57 LED1.A | LED1.A 19.01,19.98 17.41,18.37 C16.A 16.68,17.7 16,17.7 15.71,17.41 C17.2 | U2.5 16.54,23.12 16.73,23.31 18.23,23.31 LED1.A
6  (via drill 0.25)
  Top 0.203: UC1.15 33.93,16.31 33.93,16.3 32.4,14.77 v32.4,14.74
  Bottom 0.203: U$3.16 26.67,16.78 26.67,15.77 27.16,15.28 30.05,15.28 30.59,14.74 31.46,14.74 31.61,14.59 32.03,14.59 32.18,14.74 v32.4,14.74
7  (via drill 0.25)
  Top 0.203: UC1.14 35.09,16.76 35.09,18.29 35.23,18.44 35.23,20.37 35.08,20.51 33.86,20.51 33.67,20.32 33.25,20.32 32.86,20.71 31.74,20.71 31.45,21.01 31.45,21.54 31.8,21.89 31.8,25.42 31.75,25.47 31.75,26.16 v31.44,26.47
  Bottom 0.203: R22.1 31.26,26.48 v31.43,26.48 v31.44,26.47 v31.45,26.47 R23.2
8  (via drill 0.25)
  Top 0.203: v34.76,14.89 34.98,15.1 UC1.13
  Bottom 0.203: PAD23.1 34.49,7.44 34.49,14.33 34.76,14.6 v34.76,14.89
10  (via drill 0.25)
  Top 0.203: v33.64,14.53 33.64,14.43 34.61,13.47 UC1.11
  Bottom 0.203: v33.64,14.53 33.64,14.32 33.7,14.26 33.7,12.99 U$3.8
11  (via drill 0.25)
  Top 0.203: v33.19,14.05 33.35,14.05 34.18,13.22 34.18,13.2 UC1.10
  Bottom 0.203: U$3.7 31.6,12.46 31.7,12.56 32.76,12.56 33.19,12.99 v33.19,14.05
15  (via drill 0.25)
  Top 0.203: UC1.43 27.59,12.09 29.58,12.09 29.92,12.43 v30,12.43
  Bottom 0.203: v30,12.43 U$3.5
16  (via drill 0.25)
  Top 0.203: v27.29,12.88 27.29,12.5 UC1.42
  Bottom 0.203: U$3.1 26.8,12.38 v27.29,12.88
18  (via drill 0.25)
  Top 0.203: U1.12 29.72,6.67 v29.54,6.85 | UC1.40 26.14,12.59 25.79,12.25 25.79,12.04 26.62,11.21 26.62,10.7 v26.52,10.6
  Bottom 0.203: v29.54,6.85 28.97,6.28 26.74,6.28 26.28,6.73 26.28,10.37 v26.52,10.6
23_USBDP  (via drill 0.25)
  Top 0.203: UC1.33 25.76,17.38 25.76,18.62 R4.1 25.68,20.2 25.11,20.77 25.11,21.88 25.33,22.1 25.99,22.1 26.94,23.05 26.94,23.06 v28.78,24.9
  Bottom 0.203: R3.1 28.91,24.9 v28.78,24.9
24_USBDM  (via drill 0.25)
  Top 0.203: UC1.32 26.49,17.52 26.15,17.87 26.15,18.09 29.42,21.36 29.42,23.66 v29.54,23.78
  Bottom 0.203: v29.54,23.78 29.52,23.8 R2.1
25  (via drill 0.25)
  Top 0.203: UC1.31 27.03,17.52 27.04,17.52 28.04,16.51 28.04,12.8 v27.95,12.8
  Bottom 0.203: v27.95,12.8 27.6,12.45 27.6,12.09 U$3.2
26  (via drill 0.25)
  Top 0.203: UC1.30 27.29,17.96 27.29,17.95 28.4,16.85 28.4,13.34 v28.82,12.92
  Bottom 0.203: U$3.3 28.39,12.5 v28.82,12.93 v28.82,12.92
27  (via drill 0.25)
  Top 0.203: UC1.29 27.55,18.3 29.43,16.42 29.43,14.66 29.48,14.61 29.48,12.89 v29.5,12.87
  Bottom 0.203: U$3.4 29.2,12.56 v29.5,12.87
32  (via drill 0.25)
  Top 0.203: UC1.44 UC1.45 27.38,10.47 v27.19,10.47
  Bottom 0.203: v27.19,10.47 27.14,10.42 R9.2 27.24,9.68 SJ1.1
33  (via drill 0.25)
  Top 0.203: UC1.19 33.34,18.55 v33.34,18.58
  Bottom 0.203: R1.2 29.93,21.93 29.93,21 30.88,20.05 30.88,18.8 31.11,18.58 v33.34,18.58
+5V/2  (via drill 0.25)
  Top 0.203: R28.2 34.58,19.61 34.58,18.78 v34.44,18.64
  Bottom 0.203: PAD25.1 27.45,26.89 D5.2 28.76,26.79 29.43,27.46 35.3,27.46 35.51,27.25 35.51,22.03 34.03,20.55 34.03,18.94 34.33,18.64 v34.44,18.64
DGND  (via drill 0.25)
  Top 0.203: U1.9 28,5.12 U1.25 | U1.1 26.5,4.13 U1.25 | C6.2 C12.1 C14.1 30.64,0.8 | 30.64,0.8 C13.1 32.8,0.8 C8.1 | 30.64,0.8 32.03,2.19 32.03,6.63 31.53,7.13 | 31.53,7.13 31.53,7.65 31.87,7.99 32.85,7.99 32.86,8 C9.1 33.08,8.64 SJ4.2 34.96,9.26 C18.1 34.98,9.71 35.06,9.78 v35.06,9.81 | 31.53,7.13 v31.51,7.11 | v31.51,7.11 | v30.09,7.24 30.09,7.14 30.37,6.85 30.37,6.39 30.12,6.14 29.74,6.14 U1.11 28.5,6.12 U1.25 | U1.25 27.75,5.4 26.5,6.65 U1.18 26.5,8 | UC1.47 v28.11,9.79 v28.11,9.78 27.85,9.51 27.5,9.51 27.35,9.36 27.35,8.24 27.11,8 26.5,8 | UC1.8 34.03,11.93 v35.03,11.93 | UC1.35 25.08,16.64 25.08,17.23 v25.17,17.32 | v25.32,8.18 25.51,8 26.5,8 | v24.91,22.95 24.91,24.8 U5.1 27.2,27.09 C5.2 | C7.2 C5.2 | C5.2 v32.88,26.57 v32.89,26.57 | v33.46,20.83 33.21,21.08 C20.2 33.21,21.49 33.63,21.91 33.63,23.54 R27.1 34.77,26.53 v34.78,26.54 35.52,25.8 35.52,22.33 35.39,22.19 v35.39,20.95 | UC1.23 30.57,18.61 30.57,18.1 v30.41,17.94 | v28.91,15.85 28.91,14.46 v28.97,14.4
  Bottom 0.203: v31.51,7.11 31.39,7.24 v30.09,7.24 30.09,8.14 R9.1 28.43,9.78 v28.11,9.78 | v35.06,9.81 35.06,11.91 v35.03,11.93 35.54,12.44 35.54,20.55 35.39,20.7 v35.39,20.95 | 25.14,14.76 25.14,17.29 v25.17,17.32 25.07,17.42 25.07,20.27 D1.C 25.37,22.03 PAD24.1 25.54,22.95 v24.91,22.95 | 25.14,14.76 25.14,8.37 v25.32,8.18 | C4.1 31.94,25.15 R23.1 32.46,25.67 32.46,25.76 33.21,26.51 PAD15.1 34.01,26.54 v34.78,26.54 34.75,26.57 v32.89,26.57 | Q4.2 32.88,19.81 33.46,20.38 v33.46,20.83 | v30.41,17.94 30.09,17.62 30.09,17.41 29.97,17.29 29.97,16.94 U$3.12 29.8,16.71 29.4,16.71 U$3.13 29.2,16.14 v28.91,15.85 | 25.14,14.76 25.75,14.15 28.66,14.15 28.91,14.4 v28.97,14.4
DISC
  Top 0.203: R25.1 27,9.3 27,9.51 27.36,9.87 27.49,9.87 UC1.46
MAG_GND  (via drill 0.25)
  Top 0.203: v5.01,23.03 5.61,23.63 D3.C v6.51,24.01 | v2.31,17.35 U4.4 | U4.4 2.76,17.34 5.52,20.09 v5.52,21.41 | D4.C 6.17,14.51 4.96,15.72 4.96,16.8 4.43,17.34 U4.4
  Bottom 0.203: v5.52,21.41 PAD4.1 5.04,23 v5.01,23.03 | v6.51,24.01 | v6.51,24.01 6.22,24.31 C15.2 | v2.31,17.35 3.81,17.35 4.27,17.81 4.39,17.81 SJ7.2
MAG_OUT  (via drill 0.25)
  Top 0.203: U4.3 v2.31,18.62
  Bottom 0.203: v2.31,18.62 2.31,19.09 2.87,19.64 2.87,21.53 3.22,21.88 PAD13.1
MAG_PWR  (via drill 0.25)
  Top 0.203: v2.31,19.88 U4.1 2.45,21.01 3.55,21.01 v4.5,20.06 | R24.2 5.66,16.61 4.65,17.62 4.65,18.72 6.03,20.1 6.03,21.69 5.66,22.06 R21.2
  Top 0.254: R21.2 6.45,22.3 PAD7.1
  Bottom 0.203: C15.1 4.35,24.31 2.97,24.31 2.29,23.63 2.29,19.89 v2.31,19.88 | PAD7.1 6.83,21.34 5.88,20.39 4.87,20.39 4.5,20.02 SJ8.1 v4.5,20.05 v4.5,20.06
  other vias: 6.83,21.92
MOT1_IN1  (via drill 0.25)
  Bottom 0.203: U$1.9 14.33,16.1 14.11,15.88 13.69,15.88 13.33,16.25 13.33,16.7 12.98,17.05 12.98,18.08 13.34,18.43 13.34,19.15 12.97,19.52 12.97,23.61 13.56,24.19 16.79,24.19 17.14,23.84 19.36,23.84 19.83,24.31 IC4.2
  other vias: 21.11,24.31
MOT1_IN2  (via drill 0.25)
  Bottom 0.203: IC4.3 20.6,25.58 19.21,24.19 17.29,24.19 16.93,24.55 13.34,24.55 12.61,23.83 12.61,19.37 12.98,19 12.98,18.58 12.62,18.23 12.62,16.9 12.97,16.55 12.97,16.12 12.72,15.87 12.72,14.39 14.55,12.57 U$1.8
  other vias: 21.11,25.58
MOT2_IN1  (via drill 0.25)
  Top 0.203: IC6.2 v21.62,18.77 v21.62,18.76
  Bottom 0.203: U$1.11 16.45,16.4 16.45,16.81 16.6,16.96 21.35,16.96 21.64,17.25 21.64,18.75 v21.62,18.76
MOT2_IN2  (via drill 0.25)
  Top 0.203: IC6.3 v21.62,20.04
  Bottom 0.203: U$1.10 15.65,16.4 15.65,16.81 16.16,17.32 21.2,17.32 21.28,17.39 21.28,18.38 21.11,18.55 21.11,18.97 21.62,19.48 v21.62,20.04
MOT3_IN1  (via drill 0.25)
  Top 0.203: v21.43,8.31 21.11,7.99 IC8.2
  Bottom 0.203: v21.43,8.31 21.43,8.97 19.34,11.05 19.34,12.29 U$1.2
MOT3_IN2  (via drill 0.25)
  Top 0.203: IC8.3 20.93,9.06 20.09,9.9 20.09,10.76 20.1,10.77 v20.1,11.19
  Bottom 0.203: v20.1,11.19 20.15,11.24 U$1.1
MOT4_IN1  (via drill 0.25)
  Top 0.203: v21.17,2.77 21.13,2.28 IC10.2
  Bottom 0.203: v21.17,2.77 21.12,2.77 20.83,3.06 20.83,4.22 19.75,5.31 19.75,9.64 17.76,11.62 17.76,12.29 U$1.4
MOT4_IN2  (via drill 0.25)
  Top 0.203: IC10.3 21.37,3.86 v21.36,3.85
  Bottom 0.203: U$1.3 18.55,11.34 20.1,9.79 20.1,5.46 21.36,4.2 v21.36,3.85
MOT5_IN1  (via drill 0.25)
  Bottom 0.203: U$1.5 16.98,12.33 16.98,12.73 17.95,13.71 20.7,13.71 IC12.2
  other vias: 21.11,13.29
MOT5_IN2  (via drill 0.25)
  Bottom 0.203: U$1.7 15.36,12.97 15.89,13.5 17.01,13.5 17.58,14.07 20.62,14.07 IC12.3
  other vias: 21.11,14.56
N$1
  Bottom 0.203: R3.2 27.76,25.45 PAD27.1
N$2
  Bottom 0.203: R1.1 28.12,20.79 D1.A
N$3
  Bottom 0.203: R2.2 PAD26.1
N$4  (via drill 0.25)
  Top 0.203: v28.72,21.66 26.95,19.89 R4.2
  Bottom 0.203: Q3.2 29.74,20.65 29.21,21.17 29.21,21.36 29.06,21.51 28.87,21.51 v28.72,21.66
N$5  (via drill 0.25)
  Top 0.203: R25.2 29.57,8.76 R26.1 v29.88,9.07 | v30.12,10.53 30.12,11.3 30.7,11.88 30.99,11.88 32.06,12.95 32.06,13.67 33.43,15.04 34.1,15.04 v34.1,15.02
  Bottom 0.203: v29.88,9.07 29.88,10.37 30.07,10.56 30.1,10.53 v30.12,10.53 | v34.1,15.02 34.1,17.03 34.34,17.27 34.62,17.27 34.94,17.6 34.94,18.85 34.78,19.01 Q4.1
N$6
  Bottom 0.203: SJ5.2 19.86,1.06 18.1,2.82 U$2.SSWTCH_-
N$7
  Top 0.203: U1.8 29.73,4.63 30.11,4.63 30.12,4.64 30.55,4.21 30.55,3.49 30.48,3.42 29.91,3.42 29.23,2.74 28.82,2.74 28.64,2.56 28.64,1.89 28.43,2.1 C12.2
N$8  (via drill 0.25)
  Top 0.203: v31.52,6.37 31.66,6.23 31.66,2.35 31.41,2.1 C13.2 | U1.20 25.3,6.12 25.14,6.29 25.14,7.02 25.27,7.15 v25.77,7.15 v25.78,7.16
  Bottom 0.203: v31.52,6.37 31.07,5.92 26.3,5.92 25.78,6.45 v25.78,7.16
N$9
  Top 0.203: C14.2 29.71,2.47 29.71,2.72 29.96,2.97 | 29.96,2.97 | 29.96,2.97 30.05,3.06 30.63,3.06 30.91,3.34 30.91,4.35 30.37,4.89 30.37,5.36 30.11,5.62 U1.10
N$10  (via drill 0.25)
  Top 0.203: 34.18,22.39 R27.2 | 34.18,22.39 v34.16,22.39 | R28.1 34.48,22.1 34.18,22.39
  Bottom 0.203: Q3.1 31.64,20.06 32.28,20.7 32.59,20.7 Q4.3 34.16,22.27 v34.16,22.39
N$11
  Top 0.61: IC12.8 15.64,12.02 15.29,12.04 PAD5.1
N$12
  Top 0.305: R16.2 15.67,18.75 IC6.7
N$13
  Top 0.61: IC12.6 13.52,14.56 PAD6.1
N$14
  Top 0.61: 15.59,9.06 IC8.6 PAD2.1 | 15.59,9.06
N$15
  Top 0.61: IC8.8 13.52,6.52 PAD1.1
N$16  (via drill 0.25)  (1 unrouted)
  Bottom 0.5: v2.76,11.04 U$5.1 v2.76,10.14
N$17
  Top 0.61: IC10.6 13.5,3.53 PAD8.1
N$18
  Top 0.61: IC10.8 PAD3.1
N$19
  Top 0.61: PAD12.1 15.67,20.06 IC6.6
N$20
  Top 0.61: IC6.8 15.59,17.5 | 15.59,17.5 | 15.59,17.5 15.59,17.49 PAD11.1
N$21
  Top 0.61: IC4.6 15.69,25.6 PAD10.1
N$22
  Top 0.61: PAD9.1 15.68,23.03 IC4.8
N$23
  Top 0.305: R17.2 15.68,2.25 IC10.7
N$24
  Top 0.305: R18.2 IC8.7
N$25
  Top 0.305: R19.2 IC12.7
N$26
  Top 0.305: R15.2 15.68,24.3 IC4.7
N$28
  Top 0.203: D3.A R21.1
N$29  (via drill 0.25)
  Top 0.203: U4.8 7.43,21.14 6.51,20.22 v6.51,18.69
  Bottom 0.203: SJ8.2 5.71,19.49 v6.51,18.69 5.75,17.93 5.53,17.93 SJ7.1
N$30
  Bottom 0.203: R20.2 14.03,18.83 14.03,18.96 13.33,19.66 13.33,20.96 14.28,21.91 16.64,21.91 LED1.C
N$32
  Top 0.203: R24.1 4.36,15.96 3.51,15.08 D4.A
N$33  (via drill 0.25)  (1 unrouted)
  Top 0.5: v2.75,1.06 v2.75,0
  Bottom 0.203: U$8.1 v2.75,0
  Bottom 0.5: v2.75,1.06 U$8.1
N$34  (via drill 0.25)
  Top 0.5: U$6.2 v3.56,10.14
  Bottom 0.5: U$5.2 v3.56,10.14 v3.56,11.04
N$35  (via drill 0.25)
  Top 0.5: U$6.3 v4.36,10.14
  Bottom 0.5: U$5.3 v4.36,10.14 v4.36,11.04
N$36  (via drill 0.25)
  Top 0.5: U$6.4 v5.16,10.14
  Bottom 0.5: U$5.4 v5.16,10.14 v5.16,11.04
N$37  (via drill 0.25)
  Top 0.5: v5.96,10.14 U$6.5
  Bottom 0.5: U$5.5 v5.96,10.14 v5.96,11.04
N$38  (via drill 0.25)
  Top 0.5: U$6.6 v6.76,10.14
  Bottom 0.5: v6.76,10.14 U$5.6 v6.76,11.04
N$39  (via drill 0.25)
  Top 0.5: v7.56,10.14 U$6.7
  Bottom 0.5: U$5.7 v7.56,10.14 v7.56,11.04
N$40  (via drill 0.25)
  Top 0.5: U$6.8 v8.36,10.14
  Bottom 0.5: U$5.8 v8.36,10.14 v8.36,11.04
N$41  (via drill 0.25)
  Top 0.5: v8.36,7.74 U$6.9
  Bottom 0.203: U$5.9 v8.36,6.84
  Bottom 0.5: v8.36,7.74 U$5.9
N$42  (via drill 0.25)
  Top 0.5: U$6.10 v7.56,7.74
  Bottom 0.5: U$5.10 v7.56,7.74 v7.56,6.84
N$43  (via drill 0.25)
  Top 0.5: U$6.11 v6.76,7.74
  Bottom 0.5: U$5.11 v6.76,7.74 v6.76,6.84
N$44  (via drill 0.25)
  Top 0.5: U$6.12 v5.96,7.74
  Bottom 0.5: U$5.12 v5.96,7.74 v5.96,6.84
N$45  (via drill 0.25)
  Top 0.5: U$6.13 v5.16,7.74 v5.16,6.84
  Bottom 0.5: U$5.13 v5.16,7.74 v5.16,6.84
N$46  (via drill 0.25)
  Top 0.5: U$6.14 v4.36,7.74
  Bottom 0.5: U$5.14 v4.36,7.74 v4.36,6.84
N$47  (via drill 0.25)
  Top 0.5: v3.56,7.74 U$6.15
  Bottom 0.5: U$5.15 v3.56,7.74 v3.56,6.84
N$48  (via drill 0.25)
  Top 0.5: v2.76,7.74 U$6.16
  Bottom 0.5: v2.76,7.74 v2.76,6.84 U$5.16
N$49  (via drill 0.25)
  Top 0.5: U$7.2 v3.55,1.06 v3.55,0
  Bottom 0.5: U$8.2 v3.55,1.06
N$50  (via drill 0.25)
  Top 0.5: U$7.3 v4.35,1.06 v4.35,0
  Bottom 0.5: U$8.3 v4.35,1.06
N$52  (via drill 0.25)
  Top 0.5: U$7.4 v5.15,1.06 v5.15,0
  Bottom 0.5: U$8.4 v5.15,1.06
N$53  (via drill 0.25)
  Top 0.5: v5.95,0 U$7.5 v5.95,1.06
  Bottom 0.203: U$8.5 v5.95,0
  Bottom 0.5: v5.95,1.06 5.95,0.38
N$54  (via drill 0.25)
  Top 0.5: U$7.6 v6.75,1.06 v6.75,0
  Bottom 0.5: v6.75,1.06 U$8.6
N$55  (via drill 0.25)  (1 unrouted)
  Top 0.5: v7.55,1.06 U$7.7
  Bottom 0.5: U$8.7 v7.55,1.06
  other vias: 7.55,0
N$56  (via drill 0.25)
  Top 0.5: U$7.8 v8.35,1.06 v8.35,0
  Bottom 0.5: v8.35,1.06 U$8.8
N$57  (via drill 0.25)
  Top 0.5: v8.35,4.28 U$7.9
  Bottom 0.203: U$8.9 v8.35,5.29
  Bottom 0.5: v8.35,4.28 U$8.9
N$58  (via drill 0.25)
  Top 0.5: v7.55,5.29 U$7.10 v7.55,4.28
  Bottom 0.203: U$8.10 7.55,4.92
  Bottom 0.5: 7.55,4.92 v7.55,4.28
N$61  (via drill 0.25)
  Top 0.5: U$7.11 v6.75,4.28 v6.75,5.29
  Bottom 0.5: v6.75,4.28 U$8.11
N$62  (via drill 0.25)
  Top 0.5: U$7.12 v5.95,4.28 v5.95,5.29
  Bottom 0.203: U$8.12 v5.95,5.29
  Bottom 0.5: v5.95,4.28 v5.95,5.29
N$63  (via drill 0.25)
  Top 0.5: U$7.13 v5.15,4.28 v5.15,5.29
  Bottom 0.5: U$8.13 v5.15,4.28
N$64  (via drill 0.25)  (1 unrouted)
  Top 0.5: v4.35,4.28 v4.35,5.29
  Bottom 0.203: U$8.14 v4.35,5.29
  Bottom 0.5: U$8.14 v4.35,4.28
N$65  (via drill 0.25)
  Top 0.5: U$7.15 v3.55,4.28
  Bottom 0.5: U$8.15 v3.55,4.28 v3.55,5.29
N$66  (via drill 0.25)  (2 unrouted)
  Top 0.5: v2.75,4.28 U$7.16
  Bottom 0.5: 2.75,4.92 v2.75,4.28
  other vias: 2.75,5.29
OSC_IN  (via drill 0.25)
  Top 0.203: C8.2 34.81,1.48 U$9.P$1 32.38,3.9 32.38,6.81 32.08,7.11 v32.08,7.48 | v32.52,8.68 32.52,10.3 32.84,10.62 32.84,10.91 32.84,11 UC1.5
  Bottom 0.203: v32.08,7.48 32.08,8.24 v32.52,8.68
OSC_OUT  (via drill 0.25)
  Top 0.203: C9.2 34.78,7.03 34.28,6.52 v33.38,6.52 33.92,6.52 U$9.P$2 | UC1.6 33.35,11.2 v33.35,11.12
  Bottom 0.203: v33.35,11.12 33.35,6.56 v33.38,6.52
PWR_GND  (via drill 0.25, 0.35, 0.45)
  Top 0.203: v12.75,2.25 R17.1 | IC4.9 19.15,24.95 v19.2,24.9 | IC4.9 18.65,24.7 v18.69,24.7 | IC4.9 18.34,24.95 v18.09,24.7 | v17.7,25.35 18.1,24.95 IC4.9 | IC4.9 18.5,25.05 v18.5,26.1 | IC4.9 18.65,24.95 v19.2,25.5 | v20.76,17.82 21.09,17.5 IC6.1 | v13.9,16.39 13.85,16.34 v12.46,16.34 | v12.56,24.53 12.87,24.53 R15.1 | v17.7,26.35 v17.7,26.85 | v17.22,8.41 18.38,8.41 IC8.9 | IC8.9 18.4,8.4 | IC8.9 17.7,7.73 17.27,7.73 | 17.27,7.73 v17.21,7.73 | IC12.9 18.4,15.1 | IC12.9 18.4,14.35 17.75,15 | IC12.9 18.4,14.41 v17.74,15.07 | IC12.9 18.4,14.47 v19.02,15.09 | IC12.9 18.4,15.05 v18.36,15.09 | v13.05,5.34 14.79,5.34 15.39,5.95 16.56,5.95 16.7,6.1 16.7,7.16 17.27,7.73
  Top 0.254: v12.47,18.79 13.06,18.79 R16.1 | v16.84,19.59 18.21,19.59 IC6.9
  Top 0.305: v16.98,16.1 16.98,15.35 IC12.9 | 17.75,15 U$1.13
  Top 0.61: 18.4,12.02 IC12.9 | 18.4,15.1 18.4,17.5 | 18.4,23.04 IC6.9 18.4,17.5 | 18.4,23.04 IC4.9 | 18.07,5.37 18.07,7.08 18.35,7.36 18.35,8.35 18.4,8.4 18.4,12.02 | 18.07,5.37 18.07,3.23 IC10.9 18.4,1.75 19.16,0.99 IC10.1 | v21.1,11.2 IC12.1 18.4,12.02 | IC6.1 18.4,17.5 | IC4.1 18.4,23.04 | IC8.1 21.07,6.49 20.75,6.49 19.63,5.37 18.07,5.37
  Top 1.016: IC4.9 18.4,26.55 v18.2,26.55 v17.2,26.55 v17.2,25.65
  Bottom 0.203: GND.1 16.55,26.55 v17.2,26.55 18.63,26.55 18.65,26.57 20.52,26.57 PAD22.1 | C19.C 20.68,20.59 20.68,18.15 20.34,17.81 20.72,17.81 | v20.76,17.82 v20.75,17.81 20.72,17.81 | GND.1 14.93,24.93 13.18,24.93 12.78,24.53 v12.56,24.53 12.56,24.33 12.26,24.03 12.26,19.01 v12.47,18.79 12.26,18.58 12.26,16.55 v12.46,16.34 12.26,16.14 12.26,14.14 R19.1 | 13.9,17.51 v13.9,16.39 | GND.1 16.35,26.35 v17.7,26.35 | C16.C 20.72,17.81 | 16.75,26.1 17.45,26.1 v17.7,25.85 | 16.75,26.1 v17.2,25.65 | GND.1 16.75,26.1 | GND.1 17.75,26.1 v18.2,25.65 | v18.09,24.7 17.68,25.11 17.68,25.32 17.35,25.65 | v12.75,2.25 12.75,5.55 | 12.75,5.55 12.75,7.45 R18.1 | U3.5 17.16,8.47 v17.22,8.41 | 12.75,5.55 12.95,5.34 v13.05,5.34
  Bottom 0.254: U2.2 15.07,18.58 13.9,17.41 C17.1 13.9,17.51 | v17.5,24.7 16.9,25.3 v16.9,26.1 | v18.69,24.7 17.74,25.65 17.53,25.65 | v19.2,24.9 18.07,26.03 | 18.07,26.03 17.2,26.03 | v19.2,25.5 18.67,26.03 18.07,26.03 | v19.2,26.1 18.75,26.55 18.63,26.55 | R20.1 15.9,18.81 16.68,19.59 v16.84,19.59
  Bottom 0.305: U$1.12 v16.98,16.1 | 14.13,26.1 GND.1
  Bottom 0.61: 21.09,11.14 21.1,11.15 v21.1,11.2 | v17.2,25.65 17.2,26.03 v17.2,26.55 v18.2,26.55 | 17.35,25.65 17.53,25.65 v18.2,25.65 18.2,26.35 | 18.2,26.35 | 18.2,26.35 v18.2,26.55 | v18.2,26.55
  other vias: 13.1,13.3 13.1,7.8 17.75,16.1
  pour Bottom: 11.3,27.65 22.5,27.65 22.5,0.25 11.3,0.25
PWR_VCC  (via drill 0.25)
  Top 0.203: v18.82,6.08 18.82,6.1 19.88,7.16 v22.14,7.16 | 21.66,26.85 IC4.4 21.65,26.85 21.66,26.85
  Top 0.305: 22.25,10.35 22.25,15.9 | 22.25,15.9 22.25,21.25 | IC6.4 22.2,21.3 22.25,21.25 | U$1.15 19.62,15.83 IC12.4 21.11,15.9 22.25,15.9 | IC8.4 21.11,10.35 22.25,10.35 | 22.25,10.35 22.25,4.95 22.1,4.8 IC10.4 v21.1,5.65 | 22.25,21.25 22.25,26.4 21.8,26.85 IC4.4
  Bottom 0.203: v21.1,5.65 21.1,6.52 21.74,7.16 v22.14,7.16 | v18.82,6.08 v18.81,6.09 17.4,6.09 17.15,6.34 U3.12
  Bottom 0.305: U$1.14 U$1.15
  other vias: 19.35,16.1
RESET
  Top 0.203: C18.2 34.52,10.98 SJ4.1 33.7,10.75 33.86,10.91 33.86,11.4 UC1.7
VBAT_CUR  (via drill 0.25, 0.35)  (1 unrouted)
  Top 0.254: v16.01,21.38 16.01,21.3
  Top 0.61: IC4.5 12.1,26.85 11.75,26.5 11.75,21.3 | 11.75,21.3 11.75,15.63 | IC6.5 | 16.01,21.3 IC6.5 | IC6.5 11.75,21.3 | IC12.5 15.49,15.63 11.75,15.63 | 11.75,15.63 11.75,10.62 v14.36,10.62 15.41,10.62 IC8.5 | 11.75,10.4 11.75,5.5 12.62,4.62 13.35,4.62 13.5,4.78 15.01,4.78 15.03,4.8 IC10.5
  Bottom 0.203: SJ5.1 20.36,2.81 20.36,4.19 19.39,5.16 19.39,9.49 17.44,11.44 16.58,11.44 16.15,11.87 U$1.6 16.15,11.89 15.7,11.44 14.2,11.44 13.98,11.66 SJ6.2 | v11.7,25.45 v11.7,27.1 | v11.7,2.35 v11.7,0.7 | v11.7,4 v11.7,0.7 | v11.7,5.65 v11.7,0.7
  Bottom 0.254: 11.7,12.34 | 11.7,9.6 v11.7,12.25 11.77,12.32 SJ6.1 | SJ6.2 13.07,11.15 | C19.A 16.26,20.76 U2.1 16.02,20.85 15.67,21.2 | 15.67,21.2 15.34,21.53 14.81,21.53 14.12,20.85 U2.3 | 15.67,21.2 15.86,21.38 v16.01,21.38
  Bottom 0.61: v14.36,10.62 | v14.36,10.62 v13.78,10.62 v13.24,10.62 11.71,10.62 v11.7,10.6 | v11.7,27.1 11.7,12.34 v11.7,12.25 v11.7,10.6 | v11.7,10.6 11.7,9.6 12.23,9.07 11.7,8.54 v11.7,0.7 | 14.87,10.63 14.87,10.62 v14.36,10.62
  Bottom 0.7: v11.82,9.62 11.9,9.7
  Bottom 0.813: U3.3_4 15.66,9.83 15.12,10.37 | 15.12,10.37 14.87,10.62 | 12.23,9.07 15.3,9.07 U3.3_4 | U3.3_4 14.75,9.62 v11.82,9.62 14.37,9.62 14.79,10.04 | 14.79,10.04 15.12,10.37 | v11.82,10.11 14.73,10.11 14.79,10.04
  other vias: 11.7,23.8 11.7,22.15 11.7,20.5 11.7,18.85 11.7,17.2 11.7,15.55 11.7,13.9 11.7,7.3
  pour Top: 22.5,27.6 22.5,0.2 11.5,0.2 11.3,0.4 11.3,27.7
VBAT_IN
  Bottom 0.203: U$2.SSWTCH_+ 14.9,3.2 14.48,3.2
  Bottom 0.61: U$2.SSWTCH_+ 16.13,4.13 16.13,7.8
  Bottom 0.813: 15.05,6.3 15.05,7.18 15.42,7.55 | U3.1_2 15.55,7.62 14.17,7.62 13.87,7.31 13.87,4.23 U$2.SSWTCH_+ 14.44,3.66 14.44,6.41 | 14.44,6.91 15.05,6.3 | 15.05,6.3 15.05,5.95
  Bottom 1.016: 14.48,3.2 15.42,3.2 15.42,7.55
VCC  (via drill 0.25)
  Top 0.203: R13.2 25.12,0.8 R14.2 26.18,0.93 27.23,1.99 C6.1 27.58,1.75 27.58,1.65 27.73,1.5 29.92,1.5 30.07,1.65 30.07,2.57 30.2,2.71 30.78,2.71 31.3,3.23 31.3,5.86 31,6.16 31,7.12 30.34,7.78 | 30.34,7.78 29.45,7.78 v29.42,7.76 U1.13 | v27.47,16.08 26.99,15.6 25.42,15.6 UC1.36 25.08,16.11 24.72,16.47 24.72,17.06 24.66,17.11 24.66,18.52 24.66,18.53 24.66,18.74 24.76,18.84 24.76,22.02 26.09,23.36 26.09,23.69 | 30.34,7.78 30.34,7.83 R26.2 31.09,8.96 UC1.1 | UC1.9 33.58,13.1 33.19,13.1 | UC1.1 30.74,10.27 30.74,10.65 33.19,13.1 | v30.5,14.2 30.5,15.25 30.58,15.33 30.58,16.14 30.31,16.41 30.31,17.22 29.77,17.22 29.68,17.3 v29.68,17.93 29.68,18.42 UC1.24 | 33.19,13.1 32.59,13.1 v32.57,13.12 | U5.2 26.09,23.69 | 26.09,23.69 28.11,25.71 29.53,25.71 30.19,25.05 v30.19,22.4 | C5.1 C7.1 33.86,25.82 v33.86,25.02 33.86,24.77 U5.4 32.71,22.3 31.95,21.54 v31.95,21.22 | C20.1 32.35,19.63 31.81,20.17 31.6,20.17 v30.84,20.93 | UC1.48 UC1.1
  Bottom 0.203: v29.68,17.93 28.4,17.93 U$3.14 U$3.15 27.6,16.21 v27.47,16.08 | SJ1.2 29.2,7.99 v29.42,7.76 | v30.5,14.2 30.78,13.92 31.02,13.92 31.58,13.35 32.34,13.35 v32.57,13.12 | v30.19,22.4 30.45,22.4 30.69,22.16 Q3.3 | PAD16.1 v33.86,25.02 | v31.95,21.22 31.93,21.19 31.41,21.19 30.8,21.81 Q3.3 | v30.84,20.93 30.84,21.66 Q3.3
VIN  (via drill 0.25)
  Top 0.203: v26.61,21.26 26.54,21.33 U5.3 | v30.78,12.39 30.51,12.66 30.51,12.95 29.92,13.54 29.92,14.55 v29.99,14.62
  Bottom 0.203: U$3.6 30.8,12.37 v30.78,12.39 | v29.99,14.62 29.69,14.92 26.94,14.92 26.3,15.56 26.3,17.62 26.61,17.93 v26.61,21.26 26.89,21.26 27.52,21.89 27.52,23.02 27.66,23.16 30.43,23.16 | D5.1 30.2,26.44 30.2,26.38 30.34,26.23 30.4,26.23 30.9,25.74 R22.2 30.9,24.46 30.43,23.98 30.43,23.16 | C4.2 31.44,22.53 31.44,22.61 31.24,22.82 31.09,22.82 30.75,23.16 30.43,23.16
VIOUT  (via drill 0.25)
  Top 0.203: v16.8,14.01 16.95,13.86 16.95,12.63 17.17,12.4 v17.17,10.9
  Bottom 0.203: U$1.16 20.15,15.5 19.21,14.56 17.35,14.56 v16.8,14.01 | U3.10 18.36,7.46 18.78,7.46 19.03,7.71 19.03,9.22 18.36,9.9 18.36,9.91 17.36,10.9 v17.17,10.9

### Text on the board
tNames: Quack 1 | + | - | Quack 2 | + | - | Warranty / Viod / if visible | Quack 3 | + | - | Quack 4 | lol jks, no warrent to start with | + | Right 'round like a record, baby | Right 'round, 'round, 'round | - | Goose 5 | + | You spin me right 'round, baby | You spin me right 'round, baby | -
bNames: Smol Gnd | GROUNDDDD | Out | Gnd | 3v | 5 Pixies | Der-P | UwUSB | Spinny Mag | Der-M | G+-5 | S3G | Sometimes / On | Never gonna give you up / Never gonna let you down / Never gonna run around and desert you / Never gonna make you cry / Never gonna say goodbye / Never gonna tell a lie and hurt you Never gonna give you up / Never gonna let you down / Never gonna run around and desert you / Never gonna make you cry / Never gonna say goodbye / Never gonna tell a lie and hurt you | SBSUS In | Ded / Mount | Live Mount | Allways / On | Uselesss | More Uselesss